# EAGLE design untitled (EAGLE 9.4.2)
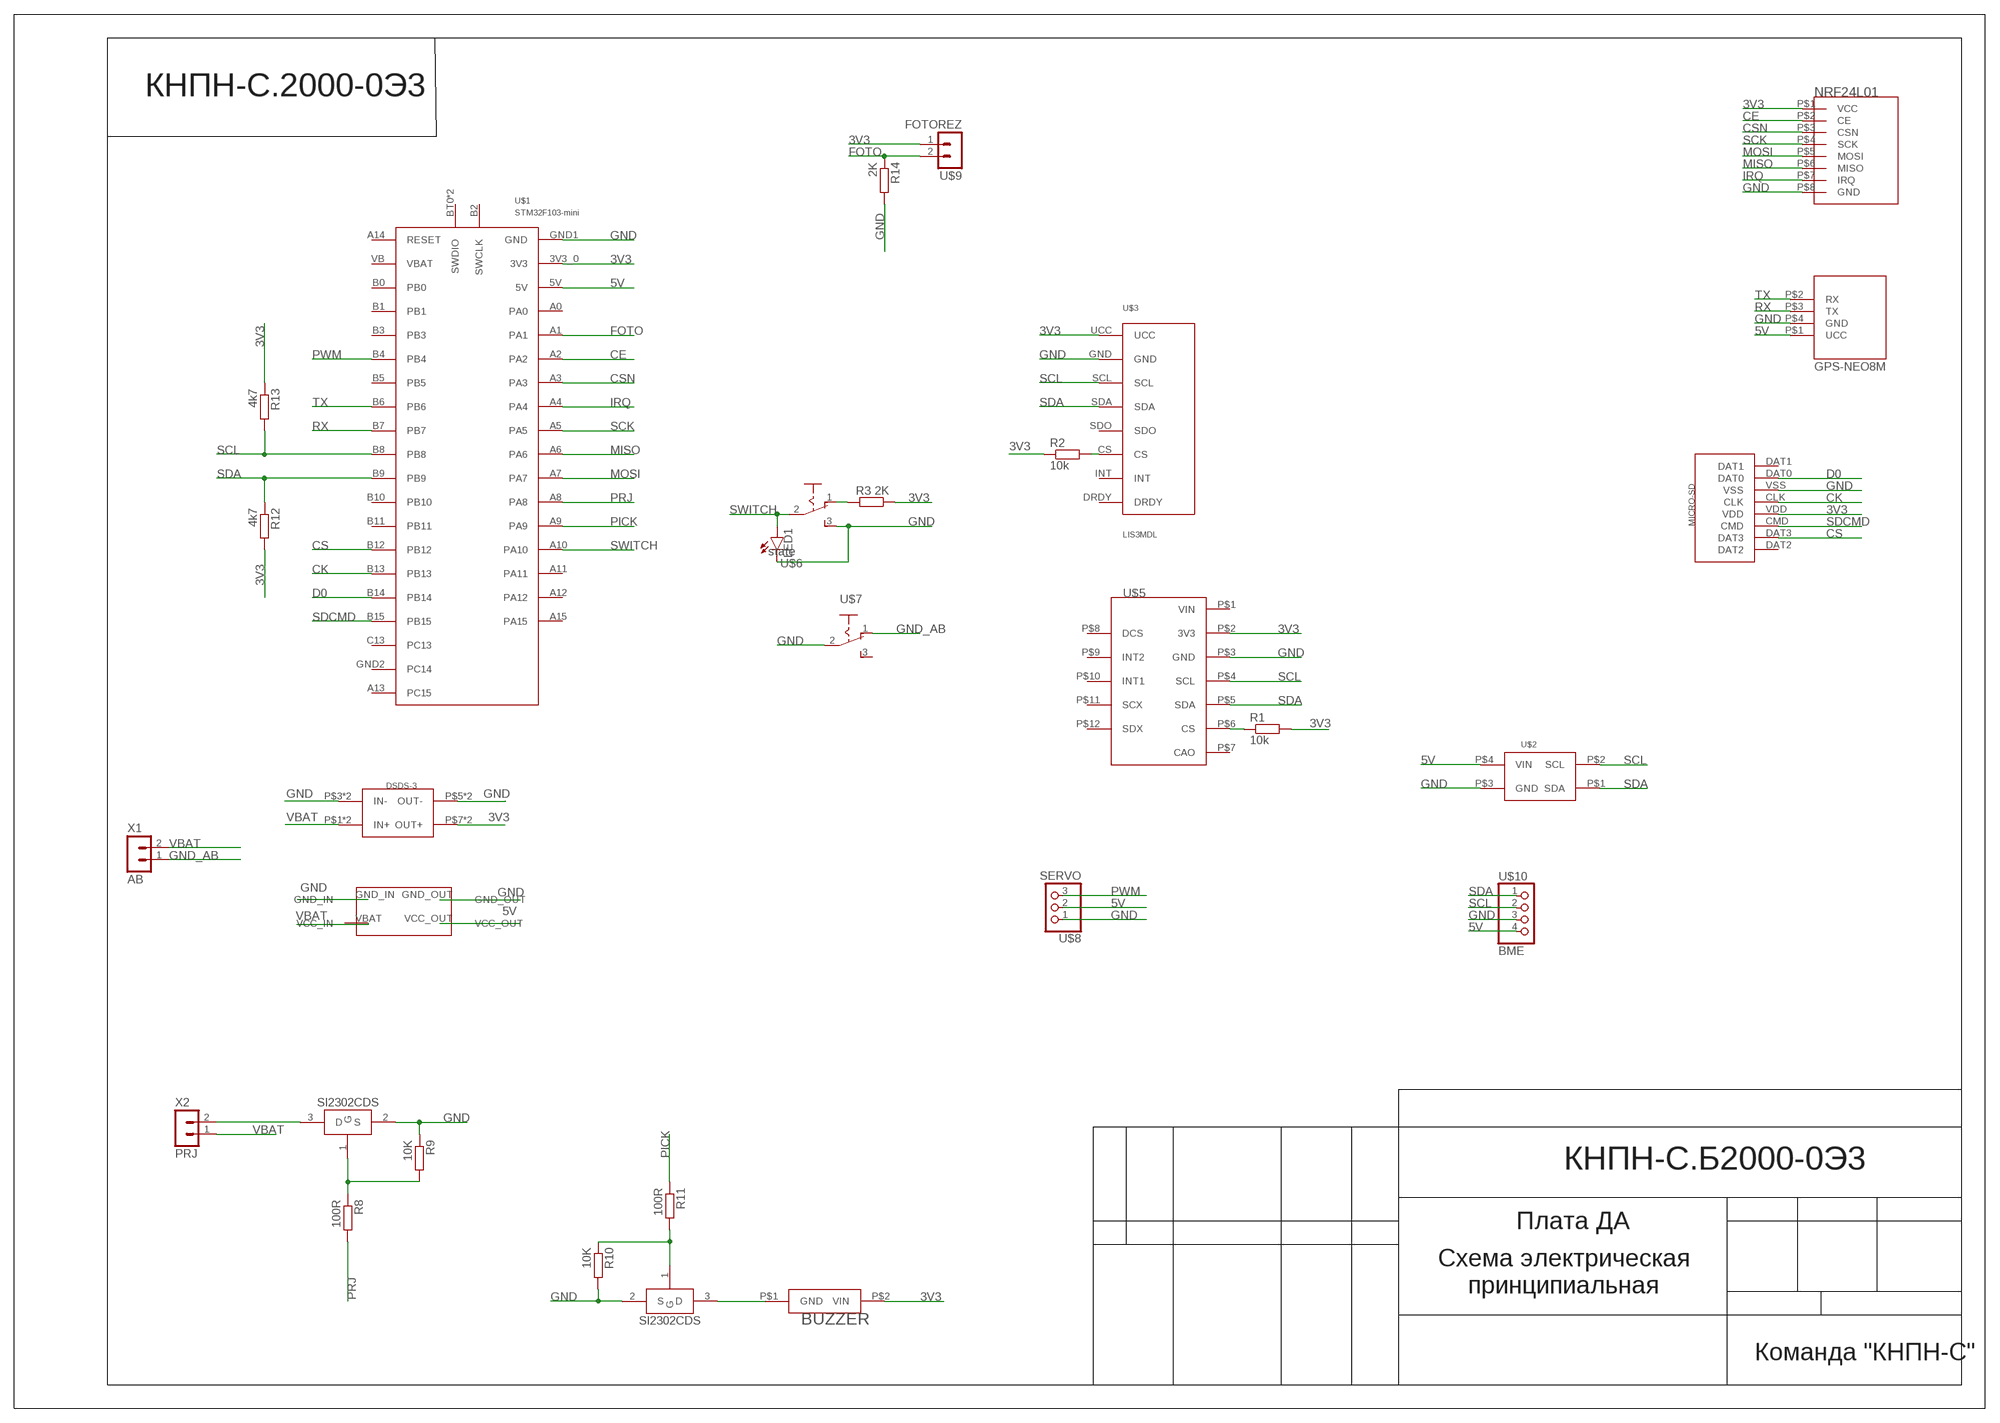
[diagram p0: schematic, sheet 1]

## Parts
BUZZER  BUZZERS8R6  [BUZZER-S8R12]
DSDS-3  MP1584-B  [MP1584-B]
DSDS-5  DS-DS_5V  [DS-DS_5V]
GPS-NEO8M  GPS-NEO8M  GPS-NEO7M  [GPS-NEO7M]
LED1  LEDCHIP-LED0603  [CHIP-LED0603]
MICRO-SD  SD  [SD]
NRF24L01  NRF24L01_ML01SP4  [NRF24L01_ML01SP4]
R1  10k  R-EU_R0603  [R0603]
R2  10k  R-EU_R0603  [R0603]
R3  2K  R-EU_R0603  [R0603]
R8  100R  R-EU_R0603  [R0603]
R9  10K  R-EU_R0603  [R0603]
R10  10K  R-EU_R0603  [R0603]
R11  100R  R-EU_R0603  [R0603]
R12  4k7  R-EU_R0603  [R0603]
R13  4k7  R-EU_R0603  [R0603]
R14  2K  R-EU_R0603  [R0603]
U$1  STM32F103-mini  BLUEPILL2_DA  [BLUEPILL2]
U$2  BME280BME280-PINS-ONLY  [BME280-PINS-ONLY]
U$3  LIS3MDL  [LIS3MDL]
U$4  SI2302CDS  [SOT23-3]
U$5  LSM6DS3-GY  [LSM6DS3-GY]
U$6  state  SWITCH_MSS  [SWITCH_MSS]
U$7  UNICS-SWITCHSS_12D11  [SS_12D11]
U$8  SERVO  MOLEX-3-1.25  [53047-03]
U$9  FOTOREZ  MOLEX-2-1.25  [53047-02]
U$10  BME  MOLEX-4-1.25  [53047-04]
U$12  SI2302CDS  [SOT23-3]
X1  AB  JST-2-2.5  [JST-2-2.5]
X2  PRJ  JST-2-2.5  [JST-2-2.5]

## Nets
3V3: BUZZER.P$2(VIN) DSDS-3.P$7(OUT+) DSDS-3.P$8(OUT+) MICRO-SD.VDD NRF24L01.P$1(VCC) R1.2 R2.1 R3.1 R12.2 R13.1 U$1.3V3_0(3V3) U$3.UCC U$5.P$2(3V3) U$9.1
5V: DSDS-5.VCC_OUT GPS-NEO8M.P$1(UCC) U$1.5V U$2.P$4(VIN) U$8.2 U$10.4
CE: NRF24L01.P$2(CE) U$1.A2
CK: MICRO-SD.CLK U$1.B13
CS: MICRO-SD.DAT3 U$1.B12
CSN: NRF24L01.P$3(CSN) U$1.A3
D0: MICRO-SD.DAT0 U$1.B14
FOTO: R14.1 U$1.A1 U$9.2
GND: DSDS-3.P$3(IN-) DSDS-3.P$4(IN-) DSDS-3.P$5(OUT-) DSDS-3.P$6(OUT-) DSDS-5.GND_IN DSDS-5.GND_OUT GPS-NEO8M.P$4(GND) LED1.C MICRO-SD.VSS NRF24L01.P$8(GND) R9.1 R10.2 R14.2 U$1.GND1(GND) U$2.P$3(GND) U$3.GND U$4.2(S) U$5.P$3(GND) U$6.3(S) U$7.2(P) U$8.1 U$10.3 U$12.2(S)
GND_AB: U$7.1(O) X1.1
IRQ: NRF24L01.P$7(IRQ) U$1.A4
MISO: NRF24L01.P$6(MISO) U$1.A6
MOSI: NRF24L01.P$5(MOSI) U$1.A7
N$1: R3.2 U$6.1(O)
N$2: R1.1 U$5.P$6(CS)
N$3: BUZZER.P$1(GND) U$4.3(D)
N$4: R8.1 R9.2 U$12.1(G)
N$5: U$12.3(D) X2.2
N$6: R10.1 R11.2 U$4.1(G)
N$7: R2.2 U$3.CS
PICK: R11.1 U$1.A9
PRJ: R8.2 U$1.A8
PWM: U$1.B4 U$8.3
RX: GPS-NEO8M.P$3(TX) U$1.B7
SCK: NRF24L01.P$4(SCK) U$1.A5
SCL: R13.2 U$1.B8 U$2.P$2(SCL) U$3.SCL U$5.P$4(SCL) U$10.2
SDA: R12.1 U$1.B9 U$2.P$1(SDA) U$3.SDA U$5.P$5(SDA) U$10.1
SDCMD: MICRO-SD.CMD U$1.B15
SWITCH: LED1.A U$1.A10 U$6.2(P)
TX: GPS-NEO8M.P$2(RX) U$1.B6
VBAT: DSDS-3.P$1(IN+) DSDS-3.P$2(IN+) DSDS-5.VBAT(VCC_IN) X1.2 X2.1
Unconnected: MICRO-SD.DAT1 MICRO-SD.DAT2 U$1.A0 U$1.A11 U$1.A12 U$1.A13(PC15) U$1.A14(RESET) U$1.A15 U$1.B0 U$1.B1 U$1.B2(SWCLK) U$1.B3 U$1.B5 U$1.B10 U$1.B11 U$1.BT0(SWDIO) U$1.C13 U$1.GND2(PC14) U$1.RESET(SWDIO) U$1.VB(VBAT) U$3.DRDY U$3.INT U$3.SDO U$5.P$1(VIN) U$5.P$7(CAO) U$5.P$8(DCS) U$5.P$9(INT2) U$5.P$10(INT1) U$5.P$11(SCX) U$5.P$12(SDX) U$7.3(S)

## Notes on the sheet
- КНПН-С.2000-0Э3
- КНПН-С.Б2000-0Э3
- Плата ДА
- Схема электрическая
  принципиальная
- Команда "КНПН-С"

## Library data of the parts
BUZZER = CanCubeSat:BUZZER
DSDS-3 = UNKNOWN-2024:MP1584-B
DSDS-5 = MA:DS-DS_5V
GPS-NEO8M = UNKNOWN-2024-orig:GPS-NEO7M
LED1 = led:LED: LED OSRAM: - CHIPLED LG R971, LG N971, LY N971, LG Q971, LY Q971, LO R971, LY R971 LH N974, LH R974 LS Q976, LO Q976, LY Q976 LO Q996 - Hyper CHIPLED LW Q18S LB Q993, LB Q99A, LB R99A - SideLED LS A670, LO A670, LY A670, LG A670, LP A670 LB A673, LV A673, LT A673, LW A673 LH A674 LY A675 LS A676, LA A676, LO A676, LY A676, LW A676 LS A679, LY A679, LG A679 - Hyper Micro SIDELED® LS Y876, LA Y876, LO Y876, LY Y876 LT Y87S - SmartLED LW L88C, LW L88S LB L89C, LB L89S, LG L890 LS L89K, LO L89K, LY L89K LS L896, LA L896, LO L896, LY L896 - TOPLED LS T670, LO T670, LY T670, LG T670, LP T670 LSG T670, LSP T670, LSY T670, LOP T670, LYG T670 LG T671, LOG T671, LSG T671 LB T673, LV T673, LT T673, LW T673 LH T674 LS T676, LA T676, LO T676, LY T676, LB T676, LH T676, LSB T676, LW T676 LB T67C, LV T67C, LT T67C, LS T67K, LO T67K, LY T67K, LW E67C LS E67B, LA E67B, LO E67B, LY E67B, LB E67C, LV E67C, LT E67C LW T67C LS T679, LY T679, LG T679 LS T770, LO T770, LY T770, LG T770, LP T770 LB T773, LV T773, LT T773, LW T773 LH T774 LS E675, LA E675, LY E675, LS T675 LS T776, LA T776, LO T776, LY T776, LB T776 LHGB T686 LT T68C, LB T68C - Hyper Mini TOPLED® LB M676 - Mini TOPLED Santana® LG M470 LS M47K, LO M47K, LY M47K Source: http://www.osram.convergy.de LUXEON: - LUMILED® LXK2-PW12-R00, LXK2-PW12-S00, LXK2-PW14-U00, LXK2-PW14-V00 LXK2-PM12-R00, LXK2-PM12-S00, LXK2-PM14-U00 LXK2-PE12-Q00, LXK2-PE12-R00, LXK2-PE12-S00, LXK2-PE14-T00, LXK2-PE14-U00 LXK2-PB12-K00, LXK2-PB12-L00, LXK2-PB12-M00, LXK2-PB14-N00, LXK2-PB14-P00, LXK2-PB14-Q00 LXK2-PR12-L00, LXK2-PR12-M00, LXK2-PR14-Q00, LXK2-PR14-R00 LXK2-PD12-Q00, LXK2-PD12-R00, LXK2-PD12-S00 LXK2-PH12-R00, LXK2-PH12-S00 LXK2-PL12-P00, LXK2-PL12-Q00, LXK2-PL12-R00 Source: www.luxeon.com KINGBRIGHT: KA-3528ASYC Source: www.kingbright.com
MICRO-SD = CanCubeSat:SD
NRF24L01 = UNKNOWN-2024:NRF24L01_ML01SP4
R1-R3 R8-R14 = rcl:R-EU_: RESISTOR, European symbol; SPICEPREFIX: R
U$1 = UNKNOWN-2024:BLUEPILL: BLUEPILL
U$2 = UNKNOWN-2024:BME280
U$3 = UNKNOWN-2024:LIS3MDL
U$4 U$12 = UNKNOWN-2024:SI2302CDS
U$5 = UNKNOWN-2024:LSM6DS3-GY
U$6 = UNKNOWN-2024:SWITCH_MSS
U$7 = UNKNOWN-2024:UNICS-SWITCH: SLIDING SWITCH Distributor Buerklin, 11G810
U$8 = UNKNOWN-2024:MOLEX-3-1.25
U$9 = UNKNOWN-2024:MOLEX-2-1.25
U$10 = UNKNOWN-2024:MOLEX-4-1.25
X1 X2 = UNKNOWN-2024:JST-2-2.5: JST PH series header 2.00mm pitch disconnectable crimp style connectors, vertical (side entry type), 2 pins

## Board
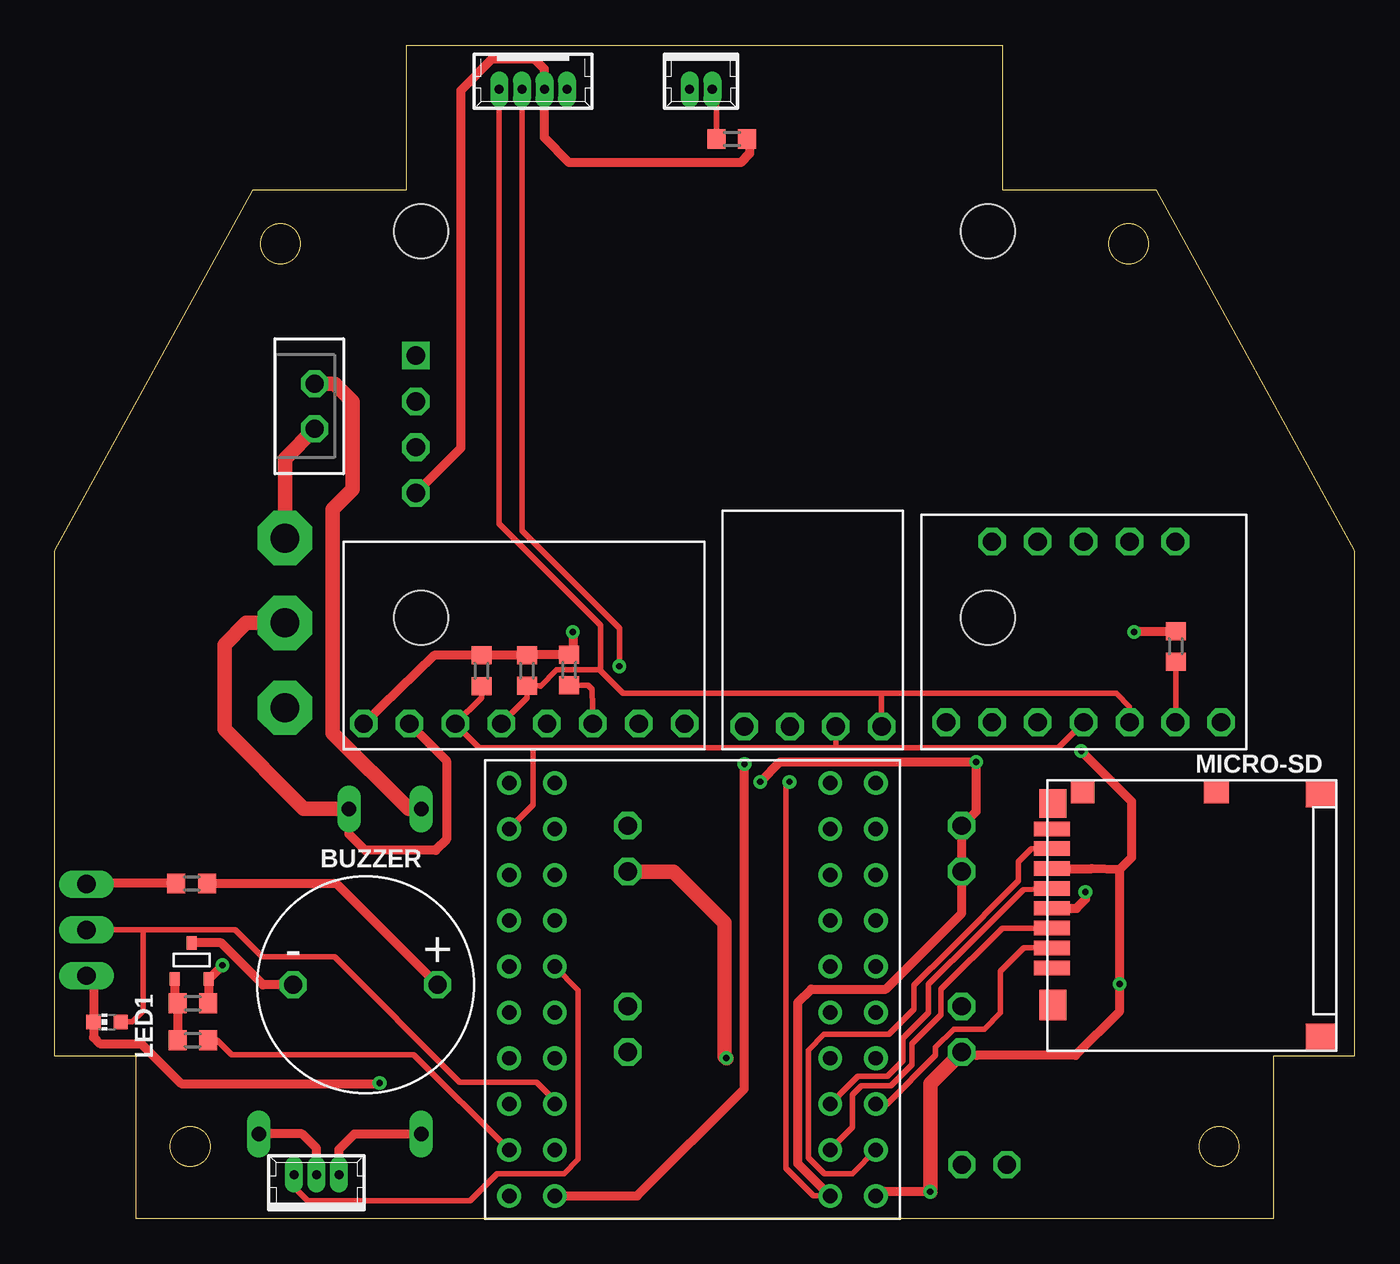
[diagram p1: board, top side]
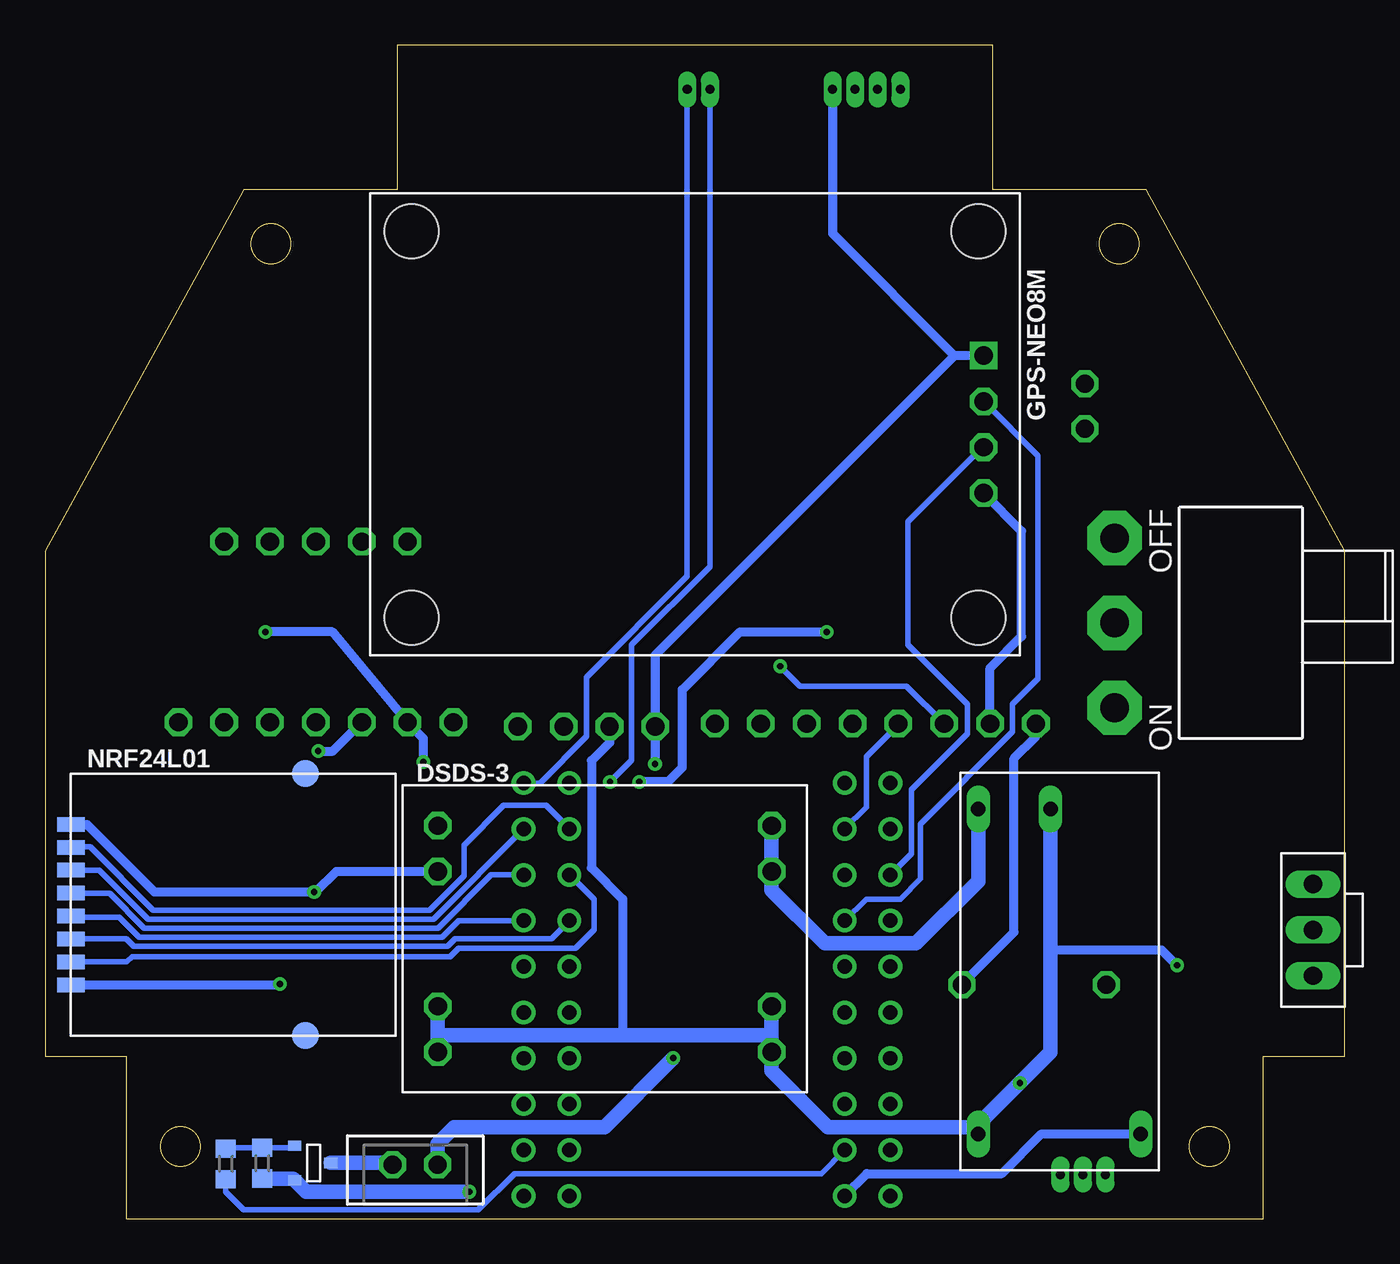
[diagram p2: board, bottom side, seen from below]

Size 72 x 65 mm. Coordinates in mm from the lower left corner, seen from the top.
Outline: 0,9 0,37 11,57 19.5,57 19.5,65 52.5,65 52.5,57 61,57 72,37 72,9 67.5,9 67.5,0 4.5,0 4.5,9 0,9
Outline: circle at 59.5,54 radius 1.1
Outline: circle at 64.5,4 radius 1.1
Outline: circle at 7.5,4 radius 1.1
Outline: circle at 12.5,54 radius 1.1
Copper layers (1*16): Top 0.035mm / dielectric 1.5mm / Bottom 0.035mm
Design rules "default *": minimum track width 6mil, minimum drill 0.35mm, track to track 0.2mm, track to pad 0.2mm, pad to pad 0.2mm, via to via 0.2mm, smd to smd 0.2mm, copper to edge 0.2mm, drill to drill 0.2mm, minimum pad ring 10mil, minimum via ring 8mil, stop-mask expansion 4mil, vias tented up to drill 0mil, thermal gap 10mil

### Footprints (pad centres in the part's own frame; a part is rotated, then mirrored left to right if it is on the bottom)
BUZZER-S8R12 = drill 1 octagon: P$1 -4,0; P$2 4,0
MP1584-B = drill 1.016 octagon: P$1 -9.25,-6.27; P$2 -9.25,-3.73; P$3 -9.25,3.73; P$4 -9.25,6.27; P$5 9.25,6.27; P$6 9.25,3.73; P$7 9.25,-3.73; P$8 9.25,-6.27
DS-DS_5V = drill 0.8 long: GND_IN 0,-13; GND_OUT 4,5; VBAT 4,-13; VCC_OUT -5,5
GPS-NEO7M = drill 1.016 square: P$1 -3.81,16 | drill 1.016 octagon: P$2 -1.27,16; P$3 1.27,16; P$4 3.81,16 | hole 3: -10.7,15.7; 10.7,15.7; 10.7,-15.7; -10.7,-15.7
CHIP-LED0603 = smd 0.8 x 0.8: A 0,-0.75; C 0,0.75
SD = smd 0.8 x 2: CLK 6,-15.77; CMD 8.2,-15.77; DAT0 3.8,-15.77; DAT1 2.7,-15.77; DAT2 10.4,-15.77; DAT3 9.3,-15.77; VDD 7.1,-15.77; VSS 4.9,-15.77 | smd 1.5 x 1.7: P$9 0.75,-0.85; P$13 14.25,-0.85 | smd 1.6 x 1.5: P$10 1.3,-15.7 | smd 1.29 x 1.3: P$11 0.645,-14.05 | smd 1.29 x 1.4: P$12 0.645,-6.65 | smd 1.7 x 1.5: P$14 12.45,-15.7
NRF24L01_ML01SP4 = smd 1.5 x 0.8: P$1 -9,4.445; P$2 -9,3.175; P$3 -9,1.905; P$4 -9,0.635; P$5 -9,-0.635; P$6 -9,-1.905; P$7 -9,-3.175; P$8 -9,-4.445 | smd 1.5 x 1.5: P$9 4,7.25; P$10 4,-7.25
R0603 = smd 1 x 1.1: 1 -0.85,0; 2 0.85,0
BLUEPILL2 = drill 0.8: 3V3_0 -11.43,-7.62; 5V -11.43,7.62; A0 11.43,-7.62; A1 11.43,-10.16; A2 8.89,-7.62; A3 8.89,-10.16; A4 6.35,-7.62; A5 6.35,-10.16; A6 3.81,-7.62; A7 3.81,-10.16; A8 -8.89,7.62; A9 -8.89,10.16; A10 -6.35,7.62; A11 -6.35,10.16; A12 -3.81,7.62; A13 -3.81,10.16; A14 -1.27,7.62; A15 -1.27,10.16; B0 1.27,-10.16; B1 -1.27,-10.16; B2 -1.27,-7.62; B3 1.27,10.16; B4 1.27,7.62; B5 3.81,10.16; B6 3.81,7.62; B7 6.35,10.16; B8 8.89,10.16; B9 8.89,7.62; B10 -3.81,-10.16; B11 -3.81,-7.62; B12 -6.35,-10.16; B13 -6.35,-7.62; B14 -8.89,-10.16; B15 -8.89,-7.62; BT0 6.35,7.62; C13 11.43,7.62; GND1 -11.43,-10.16; GND2 -11.43,10.16; RESET 1.27,-7.62; VB 11.43,10.16
BME280-PINS-ONLY = drill 1.016 octagon: P$1 -3.81,5.33; P$2 -1.27,5.33; P$3 1.27,5.33; P$4 3.81,5.33
LIS3MDL = drill 1.016 octagon: CS -5.08,-3.81; DRDY -5.08,-8.89; GND -5.08,6.35; INT -5.08,-6.35; SCL -5.08,3.81; SDA -5.08,1.27; SDO -5.08,-1.27; UCC -5.08,8.89
SOT23-3 = smd 0.56 x 0.73: 1 -0.95,-1; 2 0.95,-1; 3 0,1
LSM6DS3-GY = drill 1.016 octagon: P$1 -7.62,-5; P$2 -5.08,-5; P$3 -2.54,-5; P$4 0,-5; P$5 2.54,-5; P$6 5.08,-5; P$7 7.62,-5; P$8 -5.08,5; P$9 -2.54,5; P$10 0,5; P$11 2.54,5; P$12 5.08,5
SWITCH_MSS = drill 1.016 long: 1 -2.54,0; 2 0,0; 3 2.54,0
SS_12D11 = drill 1.6 pad 3 octagon: 1 -4.7,0; 2 0,0; 3 4.7,0
53047-03 = drill 0.5 pad 0.698 long: 1 1.25,0.45; 2 0,0.45; 3 -1.25,0.45
53047-02 = drill 0.5 pad 0.698 long: 1 0.625,0.45; 2 -0.625,0.45
53047-04 = drill 0.5 pad 0.698 long: 1 1.875,0.45; 2 0.625,0.45; 3 -0.625,0.45; 4 -1.875,0.45
JST-2-2.5 = drill 1 pad 1.5 octagon: 1 1.25,0; 2 -1.25,0

### Placement (x,y rotation side)
BUZZER  17.21,12.96 0 top
DSDS-3  41,15.5 180 bottom
DSDS-5  16.3,9.7 180 bottom
GPS-NEO8M  36,44 270 bottom
LED1  2.9,10.9 90 top
MICRO-SD  71,24.3 270 top
NRF24L01  61.57,17.4 0 bottom
R1  62.1,31.7 90 top
R2  28.5,30.4 270 top
R3  7.58,18.57 180 top
R8  61.99,3.04 270 bottom
R9  59.97,3.08 90 bottom
R10  7.65,11.93 0 top
R11  7.65,9.89 180 top
R12  26.16,30.36 90 top
R13  23.64,30.35 270 top
R14  37.51,59.8 0 top
U$1  35.33,12.7 90 top
U$2  42,32.6 180 top
U$3  26,32.5 90 top
U$4  7.58,14.28 0 top
U$5  57,32.5 0 top
U$6  1.75,16 270 bottom
U$7  12.75,33 270 bottom
U$8  14.5,2 0 top
U$9  35.8,63 180 top
U$10  26.5,63 180 top
U$12  57.17,3.09 270 bottom
X1  14.4,45 270 top
X2  51.5,3 0 bottom

### Tracks (layer width: path | path; a pad name or v marks a point on that pad's centre or on a via)
3V3  (via drill 0.35)
  Top 0.3: R13.1 | U$1.3V3_0 42.03,1.27 40.5,2.8 40.5,24 v40.7,24.2
  Top 0.5: R3.1 15.6,18.57 BUZZER.P$2 | MICRO-SD.VDD 56.6,17.2 57.1,17.7 v57.1,18.1 | v59.8,32.5 59.85,32.55 R1.2 | R13.1 R12.2 26.2,31.25 R2.1 28.7,31.25 v28.7,32.5 | R13.1 21.02,31.2 U$3.UCC | U$1.3V3_0 41.15,3.07 41.15,11.96 41.91,12.72 46.04,12.72 50.25,16.93 DSDS-3.P$7 DSDS-3.P$8 51.05,22.57 v51.05,25.3 40.19,25.3 v39.09,24.2
  Bottom 0.3: U$9.1 35.17,36.12 39.5,31.79 39.5,25.4 v40.7,24.2
  Bottom 0.5: DSDS-3.P$7 55.87,19.23 57,18.1 v57.1,18.1 65.95,18.1 69.68,21.82 70.55,21.82 NRF24L01.P$1 | v59.8,32.5 56.08,32.5 U$5.P$2 51.92,27.47 51.05,26.6 v51.05,25.3 | v39.09,24.2 37.5,24.2 36.7,25 36.7,29.3 33.5,32.5 v28.7,32.5 | BUZZER.P$2 21.21,12.99 18.32,15.88 18.32,25.49 17.11,26.7 U$3.UCC
5V  (via drill 0.35)
  Top 0.5: DSDS-5.VCC_OUT 13.7,4.7 14.5,3.9 U$8.2 | U$1.5V 32.27,1.27 38.21,7.21 v38.21,25.19
  Bottom 0.5: v38.21,25.19 38.21,27.81 U$2.P$4 38.19,27.9 38.2,27.91 38.2,31.22 21.61,47.81 | U$1.5V 26.48,2.5 19,2.5 16.8,4.7 DSDS-5.VCC_OUT | 20.89,47.81 GPS-NEO8M.P$1 21.61,47.81 | U$10.4 28.38,54.58 21.61,47.81
CE
  Bottom 0.3: U$1.A2 44.26,22.9 46.6,22.9 48.8,20.7 48.8,19 50.7,17.1 66,17.1 69.5,20.6 70.55,20.6 NRF24L01.P$2
CK
  Top 0.3: U$1.B13 44.49,7.89 46.12,7.89 47,8.77 47,10 48.4,11.4 48.4,13 49.7,14.3 49.73,14.3 53.66,18.23
  Top 0.305: 53.66,18.23 MICRO-SD.CLK
CS
  Top 0.3: U$1.B12 46.1,6.35 48.8,9.05 48.8,9.5 49.8,10.5 51.5,10.5 52.4,11.4 52.4,13.7 53.7,15 MICRO-SD.DAT3
CSN
  Bottom 0.3: U$1.A3 50.48,16.6 66.29,16.6 69,19.3 NRF24L01.P$3
D0
  Top 0.3: U$1.B14 44.18,2.5 42.64,2.5 41.75,3.39 41.75,9.35 42.62,10.22 46.22,10.22 47.6,11.6 47.6,12.93 49.59,14.91 | MICRO-SD.DAT0 54.1,20.5 53.39,19.79 53.39,18.71
  Top 0.305: 49.59,14.91 53.39,18.71
FOTO
  Top 0.3: U$9.2 36.66,62.31 R14.1
  Bottom 0.3: U$9.2 36.42,35.58 42,30 42,26.72 44.59,24.13 U$1.A1
GND  (via drill 0.35)
  Top 0.5: R10.2 8.53,11.96 U$4.2 v9.29,14.03 v9.29,14.04 | DSDS-3.P$5 51.07,9.05 56.55,9.05 59,11.5 v59,13 59,19.25 58.95,19.3 58.98,19.33 | v56.87,25.9 59.65,23.12 59.65,20 58.98,19.33 | 58.98,19.33 57.45,19.4 MICRO-SD.VSS | DSDS-5.GND_OUT 16.6,4.7 15.75,3.85 U$8.1 | R14.2 38.5,59.66 38.5,59 38,58.5 28.5,58.5 27.12,59.88 U$10.3 27.12,63.67 26.59,64.21 24.21,64.21 22.5,62.5 22.5,42.69 GPS-NEO8M.P$4 | v48.5,1.5 45.72,1.5 U$1.GND1 | v18,7.53 17.96,7.49 7.01,7.49 4.8,9.7 2.5,9.7 2.15,10.05 LED1.C 2.15,13.06 U$6.3 | DSDS-5.GND_IN 16.3,21.3 17.2,20.4 21.1,20.4 21.7,21 21.7,25.37 U$3.GND
  Top 0.8: DSDS-3.P$5 48.5,7.48 v48.5,1.5 | DSDS-5.GND_IN 13.8,22.7 9.4,27.1 9.4,31.8 10.6,33 U$7.2
  Bottom 0.5: v56.87,25.9 56.06,25.9 U$5.P$3 | U$2.P$3 40.73,26.37 41.73,25.37 41.73,19.43 40,17.7 40,10.18 | NRF24L01.P$8 59.05,12.96 v59,13 | 16.3,14.9 10.15,14.9 v9.29,14.04 | U$3.GND 19.65,30.5 17.9,32.25 17.9,38.09 GPS-NEO8M.P$4
  Bottom 0.8: R9.1 58.26,2.23 U$12.2 57.53,1.5 v48.5,1.5 | DSDS-5.GND_IN 16.3,14.9 16.3,9.23 v18,7.53 20.3,5.23 DSDS-5.GND_OUT 20.66,5.06 28.62,5.06 31.75,8.19 DSDS-3.P$4 31.75,10.3 | DSDS-3.P$6 50.25,10.2 | 50.25,10.2 DSDS-3.P$5 | 50.25,10.2 50.23,10.18 40,10.18 31.87,10.18 31.75,10.3 | DSDS-3.P$3 31.75,10.3
GND_AB
  Top 0.8: X1.1 12.75,42.1 U$7.1
IRQ
  Bottom 0.3: U$1.A4 41.6,17.7 41.6,16 42.6,14.99 49.1,14.99 49.57,14.53 67.17,14.53 67.47,14.22 NRF24L01.P$7
MISO
  Bottom 0.3: U$1.A6 43.95,15.51 49.3,15.51 49.71,15.1 67.09,15.1 67.5,15.51 70.56,15.51 NRF24L01.P$6
MOSI
  Bottom 0.3: NRF24L01.P$5 70.52,16.71 67.9,16.71 66.79,15.6 50,15.6 49.09,16.51 U$1.A7
N$1
  Top 0.5: R3.2 1.78,18.57 U$6.1
N$2
  Top 0.3: R1.1 62.1,28.34 U$5.P$6
N$3
  Top 0.5: BUZZER.P$1 11.54,12.96 9.22,15.28 U$4.3
N$4
  Bottom 0.3: U$12.1 58.28,3.93 R9.2 61.95,3.93 R8.1
N$5
  Bottom 0.8: X2.2 52.84,3.09 U$12.3
N$6
  Top 0.5: U$4.1 6.63,12.1 R10.1 R11.2
N$7
  Top 0.3: R2.2 29.54,29.55 29.76,29.33 U$3.CS
PICK
  Top 0.3: R11.1 9,9.89 9.8,9.09 19.89,9.09 U$1.A9
PRJ
  Bottom 0.3: R8.2 61.99,1.49 61,0.5 48,0.5 46,2.5 29,2.5 27.71,3.79 U$1.A8
PWM
  Top 0.3: U$8.3 13.25,1.75 14,1 23,1 24.5,2.5 28.2,2.5 29,3.3 29,12.67 U$1.B4
RX
  Bottom 0.3: U$1.B7 24,20.21 24,23.75 20.9,26.85 20.9,28.5 24.2,31.8 24.2,38.6 20.07,42.73 GPS-NEO8M.P$3
SCK
  Bottom 0.3: NRF24L01.P$4 68.44,18.04 66.5,16.1 50.24,16.1 47.29,19.05 U$1.A5
SCL  (via drill 0.35)
  Top 0.3: 26.5,26.1 23.51,26.1 U$3.SCL 23.64,28.87 R13.2 | 26.5,26.1 43.3,26.1 | 26.5,26.1 26.5,22.92 U$1.B8 | U$10.2 25.88,38.1 31.27,32.7 v31.27,30.6 | U$2.P$2 43.27,26.13 43.3,26.1 | U$5.P$4 55.6,26.1 43.3,26.1
  Bottom 0.3: v31.27,30.6 30.17,29.5 24.27,29.5 U$3.SCL
SDA
  Top 0.3: U$3.SDA 26.16,28.85 R12.1 26.89,29.51 26.9,29.5 27.8,30.4 30.2,30.4 30.25,30.35 | 45.81,29.1 31.5,29.1 30.25,30.35 | U$10.1 24.62,38.51 30.25,32.88 30.25,30.35 | U$2.P$1 45.81,29.1 | U$5.P$5 59.54,28.36 58.8,29.1 45.81,29.1
  Bottom 0.3: U$1.B9 26.5,22.8 26.5,25.6 24.73,27.37 U$3.SDA
SDCMD
  Top 0.3: U$1.B15 44.2,5.06 44.2,6.88 44.68,7.36 46.32,7.36 47.5,8.54 47.5,9.7 49.1,11.3 49.1,12.7 52.5,16.1 MICRO-SD.CMD
SWITCH
  Top 0.3: 4.9,16 10,16 11.5,14.5 15.5,14.5 22.44,7.56 26.69,7.56 27.71,6.54 U$1.A10 | 4.9,16 4.9,11.5 4.3,10.9 LED1.A | U$6.2 4.9,16
TX
  Bottom 0.3: U$1.B6 26.51,17.71 24.61,17.71 23.5,18.82 23.5,21.86 18.4,26.96 18.4,28.5 17,29.9 17,42.27 GPS-NEO8M.P$2
VBAT  (via drill 0.35)
  Top 0.8: DSDS-5.VBAT 19.6,22.7 15.4,26.9 15.4,39.3 16.5,40.4 16.5,45.25 15.5,46.25 X1.2 | v37.2,8.9 37.1,9 37.1,16.4 34.27,19.23 DSDS-3.P$2
  Bottom 0.8: DSDS-5.VBAT 20.3,18.7 23.75,15.25 28.8,15.25 31.75,18.2 DSDS-3.P$2 DSDS-3.P$1 | v37.2,8.9 41.02,5.08 49.33,5.08 50.25,4.16 X2.1

### Text on the board
tValues: LSM6DS3 | LIS3MDL | FLT | SI2300A | DBG
bValues: ON | SI2300A | DS-DS_5V